# Altium schematic sheet Motors.SchDoc
size A
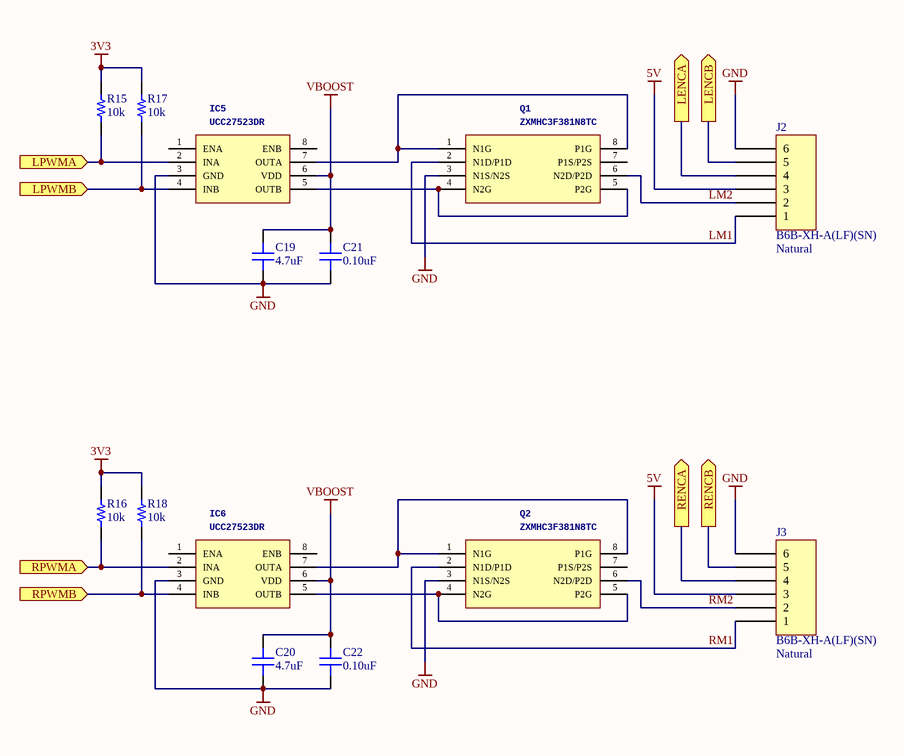
[diagram p0: Motors.SchDoc]

## Parts
C19  4.7uF  [CAP 0805/2012]
C20  4.7uF  [CAP 0805/2012]
C21  0.10uF  [CAP 0402/1005]
C22  0.10uF  [CAP 0402/1005]
IC5  UCC27523DR  [SOIC127P600X175-8N]
IC6  UCC27523DR  [SOIC127P600X175-8N]
J2  B6B-XH-A(LF)(SN)  Colour: Natural  [JST XH B6B-XH-A]
J3  B6B-XH-A(LF)(SN)  Colour: Natural  [JST XH B6B-XH-A]
Q1  ZXMHC3F381N8TC  [SOIC127P600X175-8N]
Q2  ZXMHC3F381N8TC  [SOIC127P600X175-8N]
R15  10k  [RES 0402/1005]
R16  10k  [RES 0402/1005]
R17  10k  [RES 0402/1005]
R18  10k  [RES 0402/1005]

## Ports
LENCA (out), LENCB (out), LPWMA (in), LPWMB (in), RENCA (out), RENCB (out), RPWMA (in), RPWMB (in)

## Nets
3V3: R15.2 R16.2 R17.2 R18.2
5V: J2.3 J3.3
GND: C19.1 C20.1 C21.1 C22.1 IC5.3(GND) IC6.3(GND) J2.6 J3.6 Q1.3(N1S/N2S) Q2.3(N1S/N2S)
VBOOST: C19.2 C20.2 C21.2 C22.2 IC5.6(VDD) IC6.6(VDD)
LENCA: J2.4 ; port LENCA
LENCB: J2.5 ; port LENCB
LM1: J2.1 Q1.2(N1D/P1D)
LM2: J2.2 Q1.6(N2D/P2D)
LPWMA: IC5.2(INA) R15.1 ; port LPWMA
LPWMB: IC5.4(INB) R17.1 ; port LPWMB
RENCA: J3.4 ; port RENCA
RENCB: J3.5 ; port RENCB
RM1: J3.1 Q2.2(N1D/P1D)
RM2: J3.2 Q2.6(N2D/P2D)
RPWMA: IC6.2(INA) R16.1 ; port RPWMA
RPWMB: IC6.4(INB) R18.1 ; port RPWMB
NetIC5_5: IC5.5(OUTB) Q1.4(N2G) Q1.5(P2G)
NetIC5_7: IC5.7(OUTA) Q1.1(N1G) Q1.8(P1G)
NetIC6_5: IC6.5(OUTB) Q2.4(N2G) Q2.5(P2G)
NetIC6_7: IC6.7(OUTA) Q2.1(N1G) Q2.8(P1G)

Not connected (* = marked no-connect by the designer): IC5 1(ENA) 8(ENB); IC6 1(ENA) 8(ENB); Q1 7(P1S/P2S); Q2 7(P1S/P2S)

## Library data of the parts
C19 C20 = CC0805ZRY5V6BB475: CAP CER 4.7UF 10V Y5V 0805; Manufacturer: Yageo; TemperatureRange: -30C ~ 85C; TemperatureCoefficient: Y5V (F); Tolerance: -20%, +80%; Value: 4.7uF; Part Number: CC0805ZRY5V6BB475; PartId: 13806; Supplier 1: Digi-Key; Supplier Part Number 1: 311-1371-2-ND; ComponentLink1Description: Datasheet; ComponentLink1URL: http://www.yageo.com/documents/recent/UPY-GPHC_Y5V_6.3V-to-50V_6.pdf; ComponentLink2Description: Digi-Key Listing; ComponentLink2URL: https://www.digikey.com/product-detail/en/yageo/CC0805ZRY5V6BB475/311-1371-2-ND/2103109; Voltage: 10V; Price: 0.0145; Device Package: 0805 (2012 Metric)
C21 C22 = GCM155R71C104KA55D: CAP CER 0.1UF 16V X7R 0402; Manufacturer: Murata Electronics North America; TemperatureRange: -55C ~ 125C; Tolerance: 10%; Value: 0.10uF; Part Number: GCM155R71C104KA55D; PartId: 12362; Supplier 1: Digi-Key; Supplier Part Number 1: 490-4759-2-ND; ComponentLink1Description: Datasheet; ComponentLink1URL: http://www.murata.com/~/media/webrenewal/support/library/catalog/products/capacitor/mlcc/c03e.ashx; ComponentLink2Description: Digi-Key Listing; ComponentLink2URL: https://www.digikey.com/product-detail/en/murata-electronics-north-america/GCM155R71C104KA55D/490-4759-2-ND/1641633; TemperatureCoefficient: X7R; Voltage: 16V; Price: 0.0088; Device Package: 0402 (1005 Metric)
IC5 IC6 = UCC27523DR: MANUFACTURER_NAME: Texas Instruments; GateName_1: G$1; SymbolName_1: UCC27523DR; LibraryName: micromousev2Parts; DeviceSetName: UCC27523DR; Package: SOIC127P600X175-8N; ARROW_PART_NUMBER: UCC27523DR; ARROW_PRICE/STOCK: https://www.arrow.com/en/products/ucc27523dr/texas-instruments; HEIGHT: 1.75mm; MANUFACTURER_PART_NUMBER: UCC27523DR
J2 J3 = B6B-XH-A(LF)(SN): CONN HEADER XH TOP 6POS 2.5MM; Manufacturer: JST Sales America Inc.; Pitch: 0.098" (2.50mm); Number Of Positions: 6; Part Number: B6B-XH-A(LF)(SN); PartId: 16453; Supplier 1: Digi-Key; Supplier Part Number 1: 455-2271-ND; ComponentLink1Description: Datasheet; ComponentLink1URL: http://www.jst-mfg.com/product/pdf/eng/eXH.pdf; ComponentLink2Description: Digi-Key Listing; ComponentLink2URL: http://www.digikey.com/product-detail/en/jst-sales-america-inc/B6B-XH-A(LF)(SN)/455-2271-ND/1000381; Price: 0.27; Type: Header, Shrouded; Contact Finish: Tin; Fastening Type: Detent Lock; Number Of Rows: 1; Series: XH
Q1 Q2 = ZXMHC3F381N8TC: MANUFACTURER_NAME: Diodes Inc.; GateName_1: G$1; ALLIED_NUMBER: 70438802; SymbolName_1: ZXMHC3F381N8TC; LibraryName: micromousev2Parts; DeviceSetName: ZXMHC3F381N8TC; Package: SOIC127P600X175-8N; ALLIED_PRICE/STOCK: https://www.alliedelec.com/diodes-inc-zxmhc3f381n8tc/70438802/; ARROW_PART_NUMBER: ZXMHC3F381N8TC; ARROW_PRICE/STOCK: https://www.arrow.com/en/products/zxmhc3f381n8tc/diodes-incorporated; HEIGHT: 1.75mm; MANUFACTURER_PART_NUMBER: ZXMHC3F381N8TC; RS_PART_NUMBER: 7515344P; RS_PRICE/STOCK: http://uk.rs-online.com/web/p/products/7515344P
R15-R18 = ERJ-2RKF1002X: RES SMD 10K OHM 1% 1/10W 0402; Manufacturer: Panasonic Electronic Components; TemperatureRange: -55C ~ 155C; TemperatureCoefficient: 100ppm/C; PowerRating: 0.1W, 1/10W; Value: 10k; Part Number: ERJ-2RKF1002X; PartId: 1; Supplier 1: Digi-Key; Supplier Part Number 1: P10.0KLTR-ND; ComponentLink1Description: Datasheet; ComponentLink1URL: http://industrial.panasonic.com/www-cgi/jvcr13pz.cgi?E+PZ+3+AOA0002+ERJ2RKF1002X+7+WW; ComponentLink2Description: Digikey listing; ComponentLink2URL: http://digikey.com/product-detail/en/ERJ-2RKF1002X/P10.0KLTR-ND/192073; Tolerance: 1%; Price: 0.0043; Type: Thick Film; Device Package: 0402 (1005 Metric)